# EAGLE schematic lion (EAGLE 6.5.0)
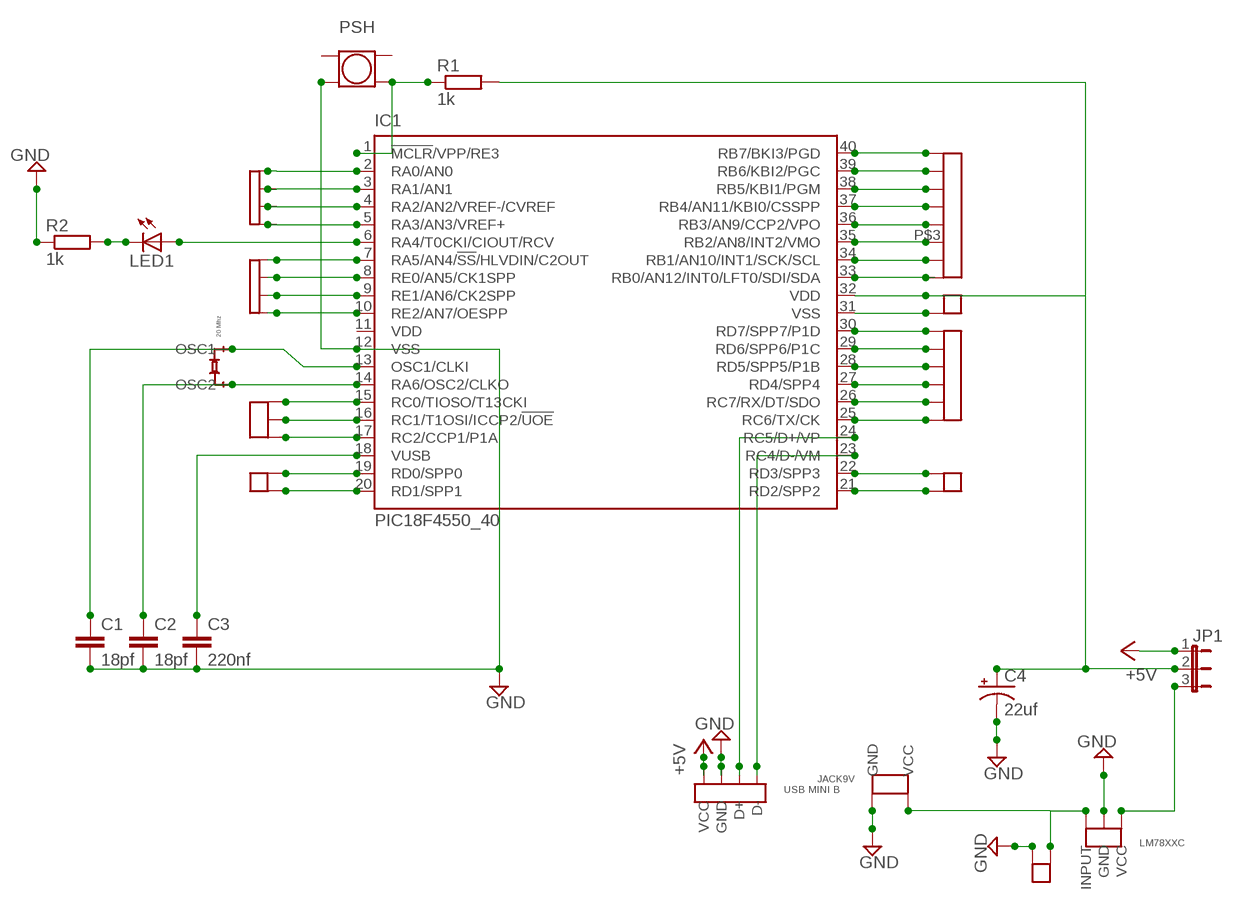
[diagram p0: schematic, sheet 1]

## Parts
BUTTON1  PUSHBTN  [PUSHBTN]
C1  18pf  C-EU050-025X075  [C050-025X075]
C2  18pf  C-EU050-025X075  [C050-025X075]
C3  220nf  C-EU050-025X075  [C050-025X075]
C4  22uf  CPOL-USE2,5-6E  [E2,5-6E]
IC1  PIC18F4550_40  [DIL40]
JACK9V  9VJACK  [9VJACK]
JP1  JP2E  [JP2]
LED1  LEDLD260  [LD260]
R1  1k  R-EU_0204/7  [0204/7]
R2  1k  R-EU_0204/7  [0204/7]
U$1  USBMINIB  [USBMINIB]
U$2  20 Mhz  CRYSTAL  [CRYSTAL]
U$3  DUBOX3  [DUBOX3]
U$4  DUBOX6  [DUBOX6]
U$5  DUBOX8  [DUBOX8]
U$6  DUBOX2  [DUBOX2]
U$7  DUBOX2  [DUBOX2]
U$8  DUBOX2  [DUBOX2]
U$9  DUBOX4  [DUBOX4]
U$10  DUBOX4  [DUBOX4]
U$11  LM7805C  [LM7805C]
U$12  DUBOX2  [DUBOX2]

## Nets
+5V: JP1.1 U$1.VCC
GND: BUTTON1.P$2(P12) C1.2 C2.2 C3.2 C4.- IC1.12(VSS) JACK9V.GND R2.1 U$1.GND U$11.GND U$12.P$1(P1)
N$1: IC1.6(RA4/T0CKI/CIOUT/RCV) LED1.A
N$2: C3.1 IC1.18(VUSB)
N$3: IC1.24(RC5/D+/VP) U$1.D+
N$4: C1.1 IC1.13(OSC1/CLKI) U$2.P$1(OSC1)
N$5: C2.1 IC1.14(RA6/OSC2/CLKO) U$2.P$2(OSC2)
N$6: JACK9V.VCC U$11.INPUT U$12.P$2(P2)
N$7: BUTTON1.P$4(P22) IC1.1(!MCLR!/VPP/RE3) R1.1
N$8: IC1.23(RC4/D-/VM) U$1.D-
N$10: IC1.2(RA0/AN0) U$9.P$1(P1)
N$11: IC1.3(RA1/AN1) U$9.P$2(P2)
N$12: IC1.4(RA2/AN2/VREF-/CVREF) U$9.P$3(P3)
N$13: IC1.19(RD0/SPP0) U$6.P$1(P1)
N$14: IC1.5(RA3/AN3/VREF+) U$9.P$4(P4)
N$15: IC1.7(RA5/AN4/!SS!/HLVDIN/C2OUT) U$10.P$1(P1)
N$16: IC1.8(RE0/AN5/CK1SPP) U$10.P$2(P2)
N$17: IC1.9(RE1/AN6/CK2SPP) U$10.P$3(P3)
N$18: IC1.10(RE2/AN7/OESPP) U$10.P$4(P4)
N$19: IC1.40(RB7/BKI3/PGD) U$5.P$8
N$20: IC1.39(RB6/KBI2/PGC) U$5.P$7
N$21: IC1.38(RB5/KBI1/PGM) U$5.P$6
N$22: IC1.37(RB4/AN11/KBI0/CSSPP) U$5.P$5
N$23: IC1.36(RB3/AN9/CCP2/VPO) U$5.P$4
N$24: IC1.35(RB2/AN8/INT2/VMO) U$5.P$3
N$25: IC1.34(RB1/AN10/INT1/SCK/SCL) U$5.P$2
N$26: IC1.33(RB0/AN12/INT0/LFT0/SDI/SDA) U$5.P$1
N$27: IC1.30(RD7/SPP7/P1D) U$4.P$6
N$28: IC1.29(RD6/SPP6/P1C) U$4.P$5
N$29: IC1.28(RD5/SPP5/P1B) U$4.P$4
N$30: C4.+ IC1.32(VDD) JP1.2 R1.2 U$7.P$2(P2)
N$31: IC1.26(RC7/RX/DT/SDO) U$4.P$2
N$32: IC1.25(RC6/TX/CK) U$4.P$1
N$33: IC1.20(RD1/SPP1) U$6.P$2(P2)
N$34: IC1.31(VSS) U$7.P$1(P1)
N$35: IC1.27(RD4/SPP4) U$4.P$3
N$36: IC1.22(RD3/SPP3) U$8.P$2(P2)
N$37: IC1.17(RC2/CCP1/P1A) U$3.P$3
N$38: IC1.16(RC1/T1OSI/ICCP2/!UOE) U$3.P$2
N$39: IC1.15(RC0/TIOSO/T13CKI) U$3.P$1
N$40: IC1.21(RD2/SPP2) U$8.P$1(P1)
N$41: JP1.3 U$11.OUTPUT(VCC)
N$43: LED1.K(C) R2.2
Unconnected: BUTTON1.P$1(P11) BUTTON1.P$3(P21)

## Power pins joined to a net without a drawn wire
VDD: IC1.11(VDD)

## Library data of the parts
BUTTON1 = leonino:PUSHBTN
C1-C3 = resistor:C-EU: CAPACITOR, European symbol
C4 = resistor:CPOL-US: POLARIZED CAPACITOR, American symbol
IC1 = microchip:PIC18F4*_40: USB Microcontrollers with nanoWatt Technology High-Performance, Enhanced Flash, 28/40/44-Pin, Source: http://ww1.microchip.com/downloads/en/devicedoc/39632c.pdf; MF: MICROCHIP; MPN: PIC18F4550-I/P; OC_FARNELL: 9321357; OC_NEWARK: 74K8623
JACK9V = leonino:9VJACK
JP1 = jumper:JP2E: JUMPER
LED1 = led:LED: LED OSRAM: - CHIPLED LG R971, LG N971, LY N971, LG Q971, LY Q971, LO R971, LY R971 LH N974, LH R974 LS Q976, LO Q976, LY Q976 LO Q996 - Hyper CHIPLED LW Q18S LB Q993, LB Q99A, LB R99A - SideLED LS A670, LO A670, LY A670, LG A670, LP A670 LB A673, LV A673, LT A673, LW A673 LH A674 LY A675 LS A676, LA A676, LO A676, LY A676, LW A676 LS A679, LY A679, LG A679 - Hyper Micro SIDELED® LS Y876, LA Y876, LO Y876, LY Y876 LT Y87S - SmartLED LW L88C, LW L88S LB L89C, LB L89S, LG L890 LS L89K, LO L89K, LY L89K LS L896, LA L896, LO L896, LY L896 - TOPLED LS T670, LO T670, LY T670, LG T670, LP T670 LSG T670, LSP T670, LSY T670, LOP T670, LYG T670 LG T671, LOG T671, LSG T671 LB T673, LV T673, LT T673, LW T673 LH T674 LS T676, LA T676, LO T676, LY T676, LB T676, LH T676, LSB T676, LW T676 LB T67C, LV T67C, LT T67C, LS T67K, LO T67K, LY T67K, LW E67C LS E67B, LA E67B, LO E67B, LY E67B, LB E67C, LV E67C, LT E67C LW T67C LS T679, LY T679, LG T679 LS T770, LO T770, LY T770, LG T770, LP T770 LB T773, LV T773, LT T773, LW T773 LH T774 LS E675, LA E675, LY E675, LS T675 LS T776, LA T776, LO T776, LY T776, LB T776 LHGB T686 LT T68C, LB T68C - Hyper Mini TOPLED® LB M676 - Mini TOPLED Santana® LG M470 LS M47K, LO M47K, LY M47K Source: http://www.osram.convergy.de LUXEON: - LUMILED® LXK2-PW12-R00, LXK2-PW12-S00, LXK2-PW14-U00, LXK2-PW14-V00 LXK2-PM12-R00, LXK2-PM12-S00, LXK2-PM14-U00 LXK2-PE12-Q00, LXK2-PE12-R00, LXK2-PE12-S00, LXK2-PE14-T00, LXK2-PE14-U00 LXK2-PB12-K00, LXK2-PB12-L00, LXK2-PB12-M00, LXK2-PB14-N00, LXK2-PB14-P00, LXK2-PB14-Q00 LXK2-PR12-L00, LXK2-PR12-M00, LXK2-PR14-Q00, LXK2-PR14-R00 LXK2-PD12-Q00, LXK2-PD12-R00, LXK2-PD12-S00 LXK2-PH12-R00, LXK2-PH12-S00 LXK2-PL12-P00, LXK2-PL12-Q00, LXK2-PL12-R00 Source: www.luxeon.com KINGBRIGHT: KA-3528ASYC Source: www.kingbright.com
R1 R2 = resistor:R-EU_: RESISTOR, European symbol
U$1 = leonino:USBMINIB
U$2 = leonino:CRYSTAL
U$3 = leonino:DUBOX3
U$4 = leonino:DUBOX6
U$5 = leonino:DUBOX8
U$6-U$8 U$12 = leonino:DUBOX2
U$9 U$10 = leonino:DUBOX4
U$11 = leonino:LM7805C